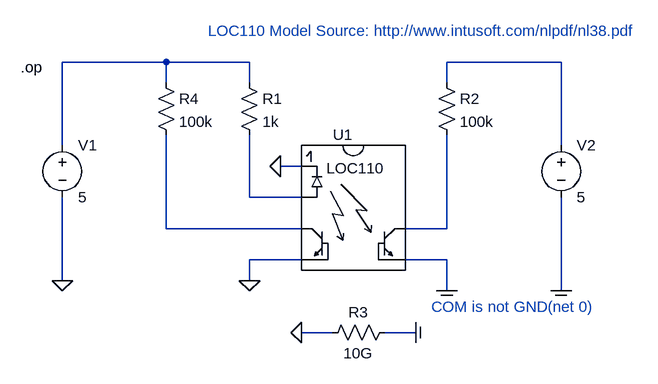
[diagram p0: schematic LOC110_test.asc]
LOC110_test.asc, the LTspice schematic file:
Version 4
SHEET 1 880 680
WIRE -176 -48 -336 -48
WIRE -48 -48 -176 -48
WIRE 432 -48 256 -48
WIRE -176 -16 -176 -48
WIRE -48 -16 -48 -48
WIRE 256 -16 256 -48
WIRE -336 80 -336 -48
WIRE 432 80 432 -48
WIRE 32 112 0 112
WIRE -48 160 -48 64
WIRE 32 160 -48 160
WIRE -176 208 -176 64
WIRE 32 208 -176 208
WIRE 256 208 256 64
WIRE 256 208 192 208
WIRE 32 256 -48 256
WIRE 256 256 192 256
WIRE -336 288 -336 160
WIRE -48 288 -48 256
WIRE 256 304 256 256
WIRE 432 304 432 160
WIRE 80 368 32 368
WIRE 208 368 160 368
FLAG 32 368 0
FLAG -48 288 0
FLAG 256 304 COM
FLAG 208 368 COM
FLAG 432 304 COM
FLAG -336 288 0
FLAG 0 112 0
SYMBOL LOC110 96 144 R0
SYMATTR InstName U1
SYMBOL res -64 -32 R0
SYMATTR InstName R1
SYMATTR Value 1k
SYMBOL res 240 -32 R0
SYMATTR InstName R2
SYMATTR Value 100k
SYMBOL res 176 352 R90
WINDOW 0 0 56 VBottom 0
WINDOW 3 32 56 VTop 0
SYMATTR InstName R3
SYMATTR Value 10G
SYMBOL res -192 -32 R0
SYMATTR InstName R4
SYMATTR Value 100k
SYMBOL voltage -336 64 R0
SYMATTR InstName V1
SYMATTR Value 5
SYMBOL voltage 432 64 R0
SYMATTR InstName V2
SYMATTR Value 5
TEXT -400 -40 Left 0 !.op
TEXT 232 328 Left 0 ;COM is not GND(net 0)
TEXT -112 -96 Left 0 ;LOC110 Model Source: http://www.intusoft.com/nlpdf/nl38.pdf

The netlist it stands for:
* LOC110_test.asc
XU1 0 N003 N004 0 COM N005 LOC110  ; pins 1A 1A1 1A2 1A3 1A4 1A5
R1 N001 N003 1k
R2 N002 N005 100k
R3 COM 0 10G
R4 N001 N004 100k
V1 N001 0 5
V2 N002 COM 5
.op
* COM is not GND(net 0)
* LOC110 Model Source: http://www.intusoft.com/nlpdf/nl38.pdf
.lib loc110.sub
.backanno
.end